# Altium schematic sheet Bo_dieu_khien_cam_tay.SchDoc
size A
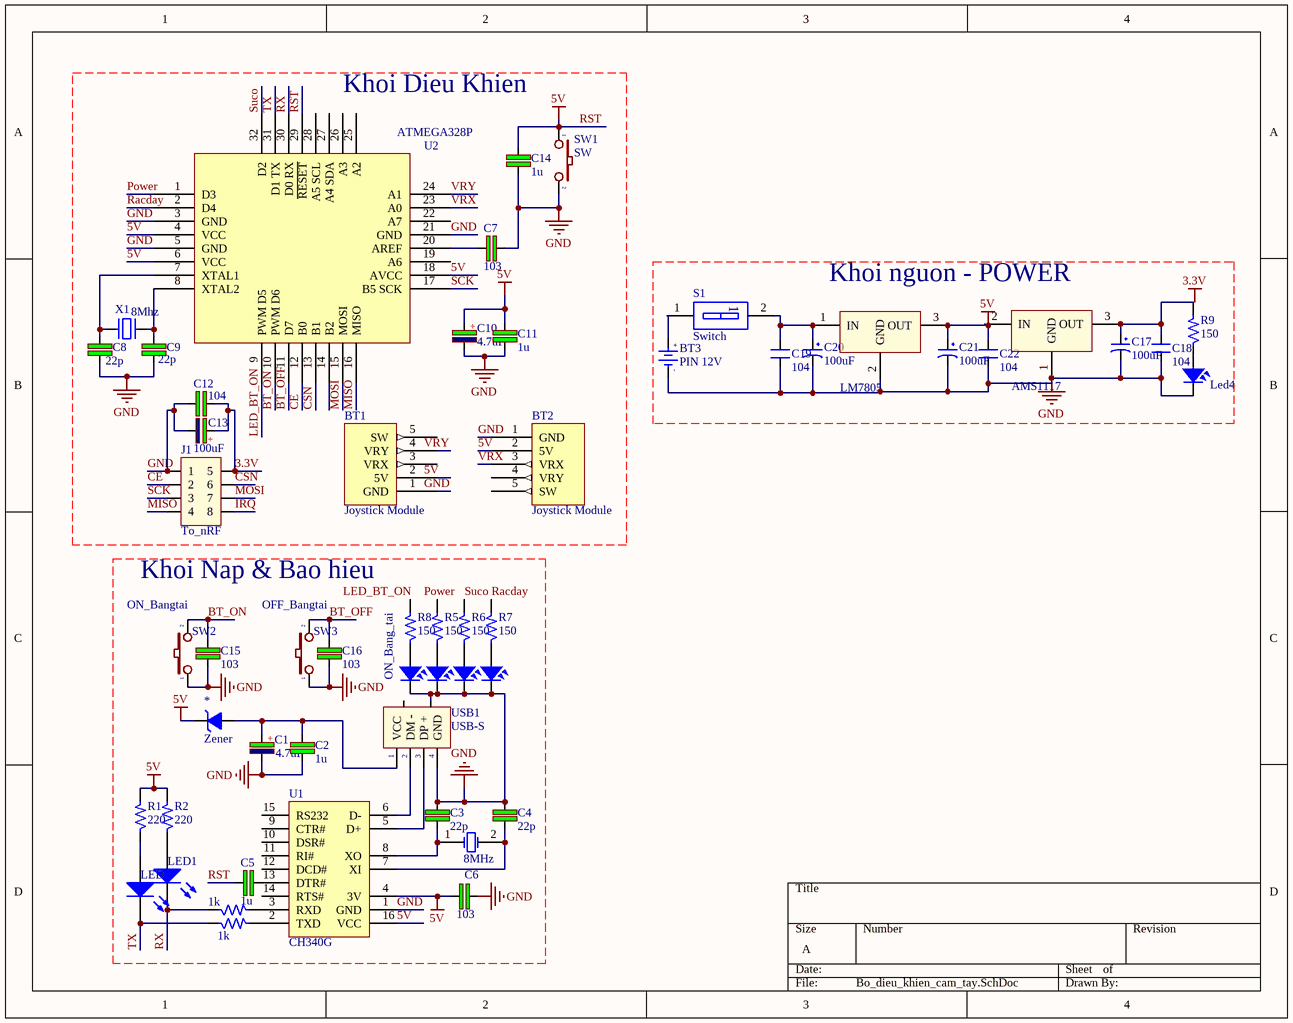
[diagram p0: Bo_dieu_khien_cam_tay.SchDoc]

## Parts
(Parts that share a designator on the sheet are numbered #1, #2 ... from top to bottom, then left to right.)
*  Zener  [D1A]
?#1  LM7805  [QTO-220]
?#2  AMS1117  [QTO-220]
?#3  LED  [LED-3MM-YELLOW]  (value not drawn)
?#4  LED  [LED-3MM-YELLOW]  (value not drawn)
?#5  LED  [LED-3MM-YELLOW]  (value not drawn)
?#6  8MHz  [R38]
?#7  LED1  [3.5X2.8X1.9]
?#8  LED  [3.5X2.8X1.9]
?#9  1k  [SM-1206]
?#10  1k  [SM-1206]
BT1  Joystick Module  [Joystick Module - duplicate2]
BT2  Joystick Module  [Joystick Module - duplicate2]
BT3  PIN 12V  [PIN3V]
C1  4.7uF  [CP4.5/19]
C2  1u  [CN3]
C3  22p  [CN3]
C4  22p  [CN3]
C5  1u  [CN3]
C6  103  [CN3]
C7  103  [C-0805]
C8  22p  [C-0805]
C9  22p  [C-0805]
C10  4.7uF  [10uF/10V]
C11  1u  [CN1.5]
C12  104  [CN1.5]
C13  100uF  [10uF/10V]
C14  1u  [CN1.5]
C15  103  [CN3]
C16  103  [CN3]
C17  100uF  [CP1.5/3.4]
C18  104  [CN2]
C19  104  [CN2]
C20  100uF  [CP1.5/3.4]
C21  100uF  [CP1.5/3.4]
C22  104  [CN2]
J1  To_nRF  [JP4x2]
Led4  LED SMD  [SM-LED-0805-Blue]  (value not drawn)
ON_Bang_tai  LED  [LED-3MM-YELLOW]  (value not drawn)
R1  220  [SM-1206]
R2  220  [SM-1206]
R5  150  [SM-1206]
R6  150  [SM-1206]
R7  150  [SM-1206]
R8  150  [SM-1206]
R9  150  [SM-RES-1206]
S1  Switch  [DIP-4]
SW1  SW  [BUTTON 2PIN TRON]
SW2  ON_Bangtai  [SW1-SMD]
SW3  OFF_Bangtai  [SW1-SMD]
U1  CH340G  [SO16]
U2  ATMEGA328P  [TQFP80P900X900X120-32N]
USB1  USB-S  [USB-S1]
X1  8Mhz  [XT2]

## Nets
3.3V: C12.1 C13.1 J1.5
5V: *.2(K) ?#1.3(OUT) ?#2.2(IN) BT2.2(5V) C5.2 C6.1 C10.1 C11.2 C14.2 C21.1 C22.2 R1.2 R2.2 SW1.1 U1.4(3V) U1.16(VCC) U2.4(VCC) U2.6(VCC) U2.18(AVCC) U2.29(~{RESET})  [also labelled RST]
GND: ?#1.2(GND) ?#2.1(GND) ?#3.2 ?#4.2 ?#5.2 BT2.1(GND) BT3.2(GND) C1.2 C2.1 C3.2 C4.2 C6.2 C7.1 C8.1 C9.1 C10.2 C11.1 C12.2 C13.2 C14.1 C15.1 C16.1 C17.2 C18.1 C19.1 C20.2 C21.2 C22.1 J1.1 Led4.2 ON_Bang_tai.2 SW1.2 SW2.1 SW3.1 U1.1(GND) U2.3(GND) U2.5(GND) U2.21(GND) USB1.4(GND) USB1.6
BT_OFF: C16.2 SW3.2 U2.11(D7)
BT_ON: C15.2 SW2.2 U2.10(PWM_D6)
CE: J1.2 U2.12(B0)
CSN: J1.6 U2.13(B1)
IRQ: J1.8
LED_BT_ON: U2.9(PWM_D5)
MISO: J1.4 U2.16(MISO)
MOSI: J1.7 U2.15(MOSI)
Power: U2.1(D3)
Racday: R7.2 U2.2(D4)
RX: ?#7.2(K) ?#9.1 U2.30(D0_RX)
SCK: J1.3 U2.17(B5_SCK)
Suco: R6.2 U2.32(D2)
TX: ?#8.2(K) ?#10.1 U2.31(D1_TX)
VRX: BT2.3(VRX) U2.23(A0)
VRY: U2.24(A1)
Net*_1: *.1(A) C1.1 C2.2 USB1.1(VCC)
Net?#1_1: ?#1.1(IN) C19.2 C20.1 S1.2(A2)
Net?#2_3: ?#2.3(OUT) C17.1 C18.2 R9.2
Net?#3_1: ?#3.1 R5.1
Net?#4_1: ?#4.1 R6.1
Net?#5_1: ?#5.1 R7.1
Net?#6_1: ?#6.1(OSC1) C3.1 U1.8(XO)
Net?#6_2: ?#6.2(OSC2) C4.1 U1.7(XI)
Net?#7_1: ?#7.1(A) R2.1
Net?#8_1: ?#8.1(A) R1.1
Net?#9_2: ?#9.2 U1.3(RXD)
Net?#10_2: ?#10.2 U1.2(TXD)
NetBT3_1: BT3.1(+3V) S1.1(A1)
NetC5_1: C5.1 U1.13(DTR#)
NetC7_2: C7.2 U2.20(AREF)
NetC8_2: C8.2 U2.7(XTAL1) X1.2
NetC9_2: C9.2 U2.8(XTAL2) X1.1
NetLed4_1: Led4.1 R9.1
NetON_Bang_tai_1: ON_Bang_tai.1 R8.1
NetU1_5: U1.5(D+) USB1.3(DP_+)
NetU1_6: U1.6(D-) USB1.2(DM_-)

Not connected (* = marked no-connect by the designer): BT1 1(GND) 2(5V) 3(VRX) 4(VRY) 5(SW); BT2 4(VRY) 5(SW); R5 2; R8 2; U1 9(CTR#) 10(DSR#) 11(RI#) 12(DCD#) 14(RTS#) 15(RS232); U2 14(B2) 19(A6) 22(A7) 25(A2) 26(A3) 27(A4_SDA) 28(A5_SCL); USB1 5

## Notes on the sheet
- Khoi Dieu Khien
- Khoi nguon - POWER
- Khoi Nap & Bao hieu
- Labels drawn without touching a wire or pin: 3.3V, 5V, GND, LED_BT_ON, Power, VRY
- (in symbol CP0_1) +
- (in symbol CP9) +
- (in symbol PIN 3V) +; -

## Library data of the parts
* = Zener: DIOT ZENER
?#1 = LM78xx: On ap +, from + 5 to + 24VDC; Value: LM7805
?#2 = LM79xx: On ap -, from - 5 to - 24VDC; Value: LM7905
?#3-?#5 ON_Bang_tai = LED: LED Single colour Green and Red; Value: LED 3 ly Single Colour
?#6 = XTAL: Crystal Oscillator; Published: 8-Jun-2000; LatestRevisionDate: 17-Jul-2002; LatestRevisionNote: Re-released for DXP Platform.; PackageReference: R38; Publisher: Altium Limited; PackageDescription: Crystal, Thru-Hole; 2 Leads; Body 3.1 x 8.2 mm (Dia.xH)
?#7 ?#8 = LED3: Typical BLUE SiC LED; Published: 8-Jun-2000; LatestRevisionDate: 17-Dec-2003; LatestRevisionNote: PCB Footprint replaced.; DatasheetVersion: 16-Apr-2002; PackageVersion: 16-Apr-2002; PackageReference: 3.5X2.8X1.9; Publisher: Altium Limited; PackageDescription: SM LED; 2 C-Bend Leads; Body 3.5 x 2.8 x 1.9 mm, inc leads (LxWxH typ)
?#9 ?#10 R1 R2 R5-R9 = R: Resistor 1/4W; Value: R1/4W - 1K
BT1 BT2 = Joystick Module: WS: 0, PULL UP 4K7; WEB: TECHMT.VN
BT3 = PIN 3V: Battery 3VDC; Value: PIN 3V
C1 = CP9: Cap 10000uF/63V; Value: 220uF/450V
C2-C6 C15 C16 = CN3: Cap np W0.3; Value: 0,047uF; Copyright: VanDungEvn
C7 = C: Cap SMD; Value: 103
C8 C9 = C: Cap SMD; Value: 103
C10 C13 = CP0_1: Cap P  0,1uF < 22uF , 16 - 50V; Value: 10uF/50V; Description 1: 10 => 220uF/6,3V/10V - 10uF => 100uF/16V; Description 2: 0,1uF => 33uF/50V - 10uF => 22uF/63V; Description 3: 0,47uF => 10uF/100V
C11 C12 C14 = CN1.5: Cap np 682pF => 104pF; Value: 0.01uF
C17 C20 C21 = CP3: Cap 100uF/35V - 470uF/16V; Value: 100uF/35V/50V; Description 1: 1000uF/6,3V - 470uF/16V - 330uF - 25V; Description 2: 220uF/35V - 100uF/50V - 63V - 4,7uF/200V; Description 3: 22uF => 33uF100V - 3,3uF => 4,7uF/250V; Description 4: 2,2uF =>3,3uF/350 - 2,2uF/400V - 1uF/450V
C18 C19 C22 = CN2: Cap np 104 => 105pF; Value: 0.1uF
J1 = JP4x2: Connector 4x2; Value: Connector 4x2
Led4 = LED-SMD-0805
S1 = SW DIP-1: DIP Switch, 2 Position, SPST; Published: 24-Mar-1999; LatestRevisionDate: 17-Jul-2002; LatestRevisionNote: Re-released for DXP Platform.; PackageReference: DIP-4; Publisher: Altium Limited
SW1-SW3 = SW2: Switch button 2 pin; Value: SW chip 2 pin
U1 = CH340G: High and Low Side Driver; Note: Pins 4, 8 and 14 are not connected; Published: 8-Jun-2000; LatestRevisionDate: 04-Mar-2005; LatestRevisionNote: Stylized 3D Model Added.; DatasheetVersion: PD60147J; PackageReference: PDIP14; Publisher: Altium Limited; PackageDescription: DIP; 14 Leads; Row Spacing 7.62 mm; Pitch 2.54 mm; ComponentLink1Description: Manufacturer Link; ComponentLink1URL: http://www.irf.com/; ComponentLink2Description: Datasheet; ComponentLink2URL: http://www.irf.com/product-info/datasheets/data/ir2110.pdf
U2 = ATMEGA328P-AU: Microchip Technology ATMEGA328P-AN, 8bit AVR Microcontroller, 20MHz, 32 kB Flash, 32-Pin TQFP
USB1 = USB_S: USB connector; Value: USB
X1 = XT2: Crystal For all Crystal 2pin.; Value: 4Mhz